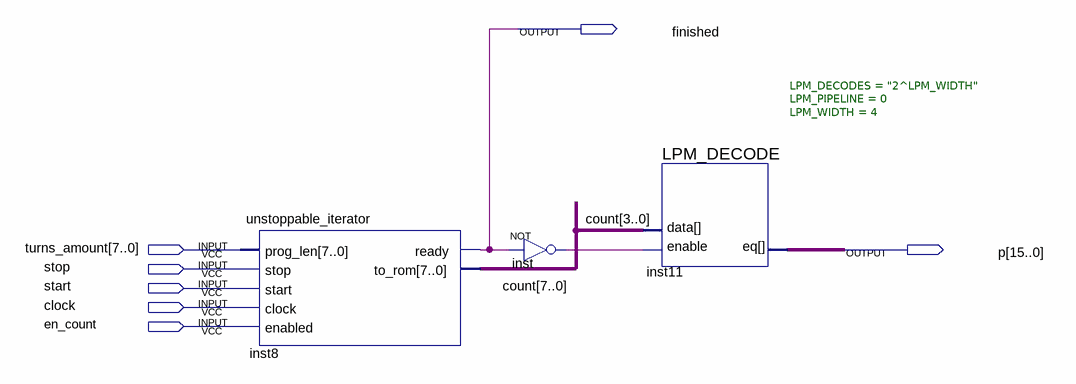
[diagram p0: schematic sheet]
// Quartus schematic turn_synchronizer.bdf as structural Verilog: 3 symbols, 7 pins
module turn_synchronizer (
  input  [7:0] turns_amount,
  input  stop,
  input  start,
  input  clock,
  input  en_count,
  output finished,
  output [15:0] p
);

  wire inst_out;
  wire [7:0] count;

  unstoppable_iterator inst8 (
    .prog_len(turns_amount), .stop(stop), .start(start), .clock(clock), .enabled(en_count), .ready(finished),
    .to_rom(count));
  not inst (inst_out, finished);
  LPM_DECODE #(.LPM_DECODES("2^LPM_WIDTH"), .LPM_PIPELINE(0), .LPM_WIDTH(4)) inst11 (
    .enable(inst_out), .data(count[3:0]), .eq(p));
endmodule
